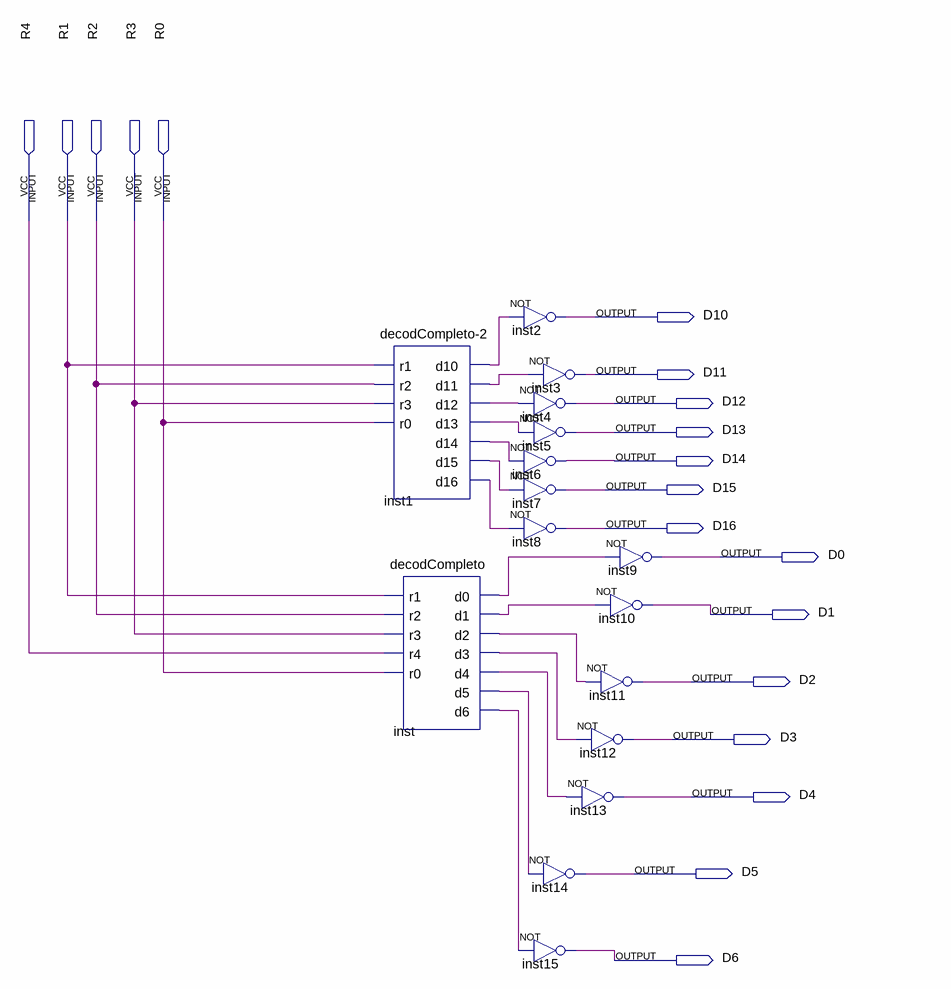
[diagram p0: schematic sheet]
// Quartus schematic decodCompletoRequiem.bdf as structural Verilog: 16 symbols, 19 pins
module decodCompletoRequiem (
  input  R4,
  input  R1,
  input  R2,
  input  R3,
  input  R0,
  output D10,
  output D11,
  output D12,
  output D13,
  output D14,
  output D15,
  output D16,
  output D0,
  output D1,
  output D2,
  output D3,
  output D4,
  output D5,
  output D6
);

  wire inst1_d10, inst1_d11, inst1_d12, inst1_d13, inst1_d14, inst1_d15, inst1_d16, inst_d0, inst_d1,
       inst_d2, inst_d3, inst_d4, inst_d5, inst_d6;

  \decodCompleto-2  inst1 (
    .r1(R1), .r2(R2), .r3(R3), .r0(R0), .d10(inst1_d10), .d11(inst1_d11), .d12(inst1_d12), .d13(inst1_d13),
    .d14(inst1_d14), .d15(inst1_d15), .d16(inst1_d16));
  decodCompleto inst (
    .r1(R1), .r2(R2), .r3(R3), .r4(R4), .r0(R0), .d0(inst_d0), .d1(inst_d1), .d2(inst_d2), .d3(inst_d3),
    .d4(inst_d4), .d5(inst_d5), .d6(inst_d6));
  not inst2 (D10, inst1_d10);
  not inst3 (D11, inst1_d11);
  not inst4 (D12, inst1_d12);
  not inst5 (D13, inst1_d13);
  not inst6 (D14, inst1_d14);
  not inst7 (D15, inst1_d15);
  not inst8 (D16, inst1_d16);
  not inst14 (D5, inst_d5);
  not inst15 (D6, inst_d6);
  not inst9 (D0, inst_d0);
  not inst10 (D1, inst_d1);
  not inst11 (D2, inst_d2);
  not inst12 (D3, inst_d3);
  not inst13 (D4, inst_d4);
endmodule
